# EAGLE schematic PL20_11 (EAGLE 4.01)

## Sheet 1 of 3
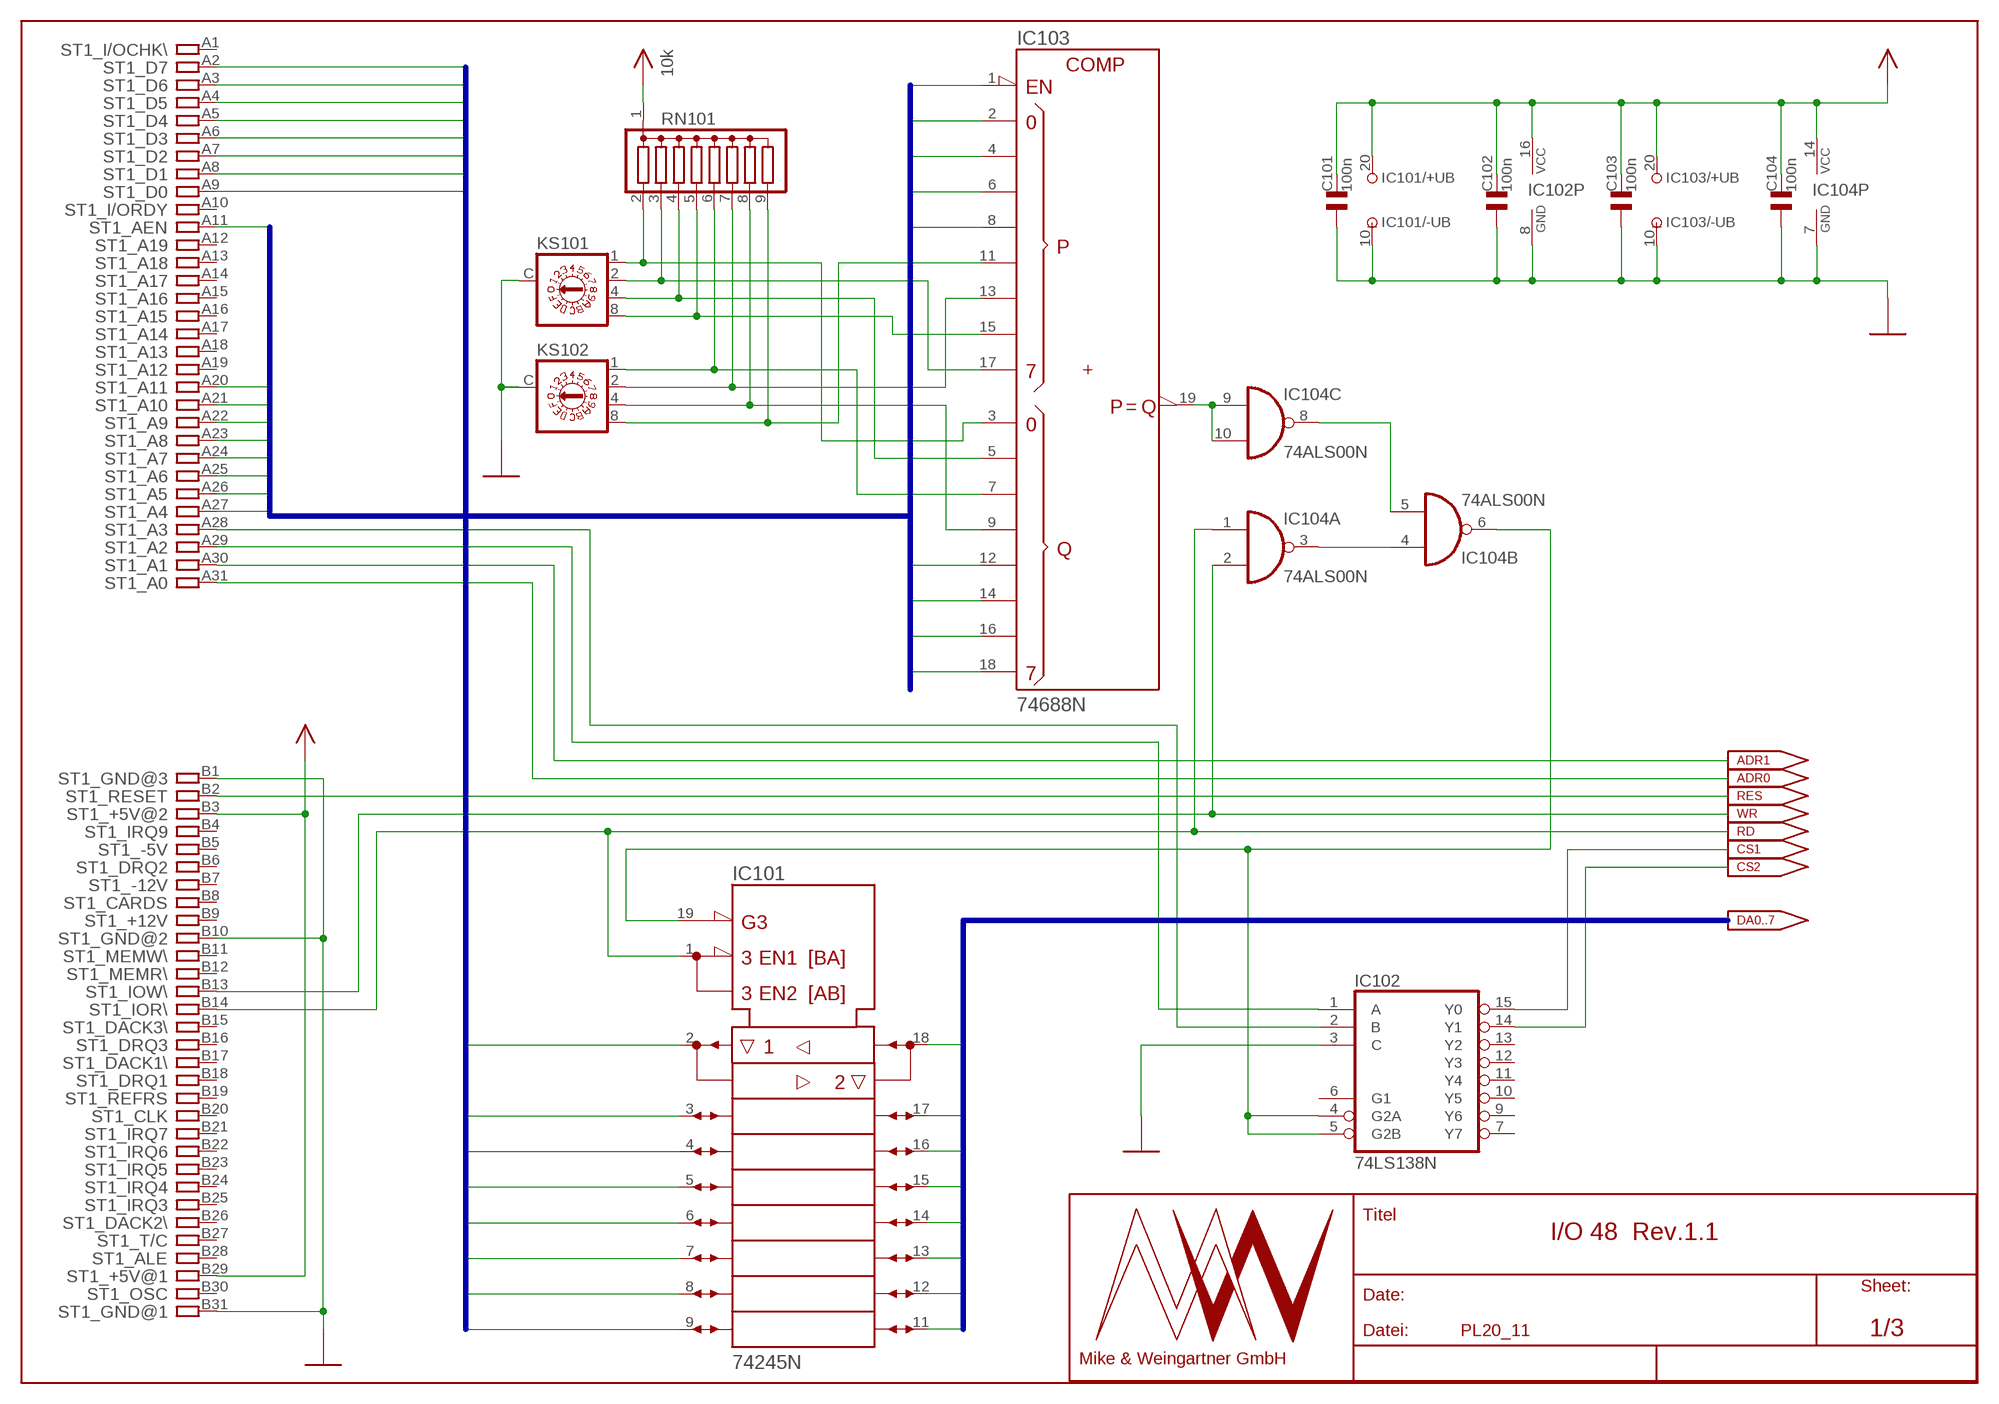
[diagram p0: schematic, sheet 1]

### Parts
C101  100n  C5B2,5  [C5B2,5]
C102  100n  C5B2,5  [C5B2,5]
C103  100n  C5B2,5  [C5B2,5]
C104  100n  C5B2,5  [C5B2,5]
IC101  74245N  [PDIP20]
IC102  74LS138N  [DIL16]
IC103  74688N  [PDIP20]
IC104  74ALS00N  [DIL14]
KS101  S10HEX  [S10HEX]
KS102  S10HEX  [S10HEX]
RN101  G08R  [SIL9]
ST1  8BITPL20"  [8BITPL20]

### Nets
+5V: C101.2 C102.2 C103.2 C104.2 IC101.20(+UB) IC102.16(VCC) IC103.20(+UB) IC104.14(P:VCC) RN101.1 ST1.B3 ST1.B29 ; supply symbol labelled 10k ; also sheet 2,3
ADR0: ST1.A31 ; also sheet 2,3
ADR1: ST1.A30 ; also sheet 2,3
ADR4: IC103.2(P0) ST1.A27
ADR5: IC103.18(Q7) ST1.A26
ADR6: IC103.4(P1) ST1.A25
ADR7: IC103.16(Q6) ST1.A24
ADR8: IC103.6(P2) ST1.A23
ADR9: IC103.14(Q5) ST1.A22
ADR10: IC103.8(P3) ST1.A21
ADR11: IC103.12(Q4) ST1.A20
AEN: IC103.1(G\) ST1.A11
CS1: IC102.15(Y0) ; also sheet 3
CS2: IC102.14(Y1) ; also sheet 2
D0: IC101.2(A1) ST1.A9
D1: IC101.3(A2) ST1.A8
D2: IC101.4(A3) ST1.A7
D3: IC101.5(A4) ST1.A6
D4: IC101.6(A5) ST1.A5
D5: IC101.7(A6) ST1.A4
D6: IC101.8(A7) ST1.A3
D7: IC101.9(A8) ST1.A2
DA0: IC101.18(B1) ; also sheet 2,3
DA1: IC101.17(B2) ; also sheet 2,3
DA2: IC101.16(B3) ; also sheet 2,3
DA3: IC101.15(B4) ; also sheet 2,3
DA4: IC101.14(B5) ; also sheet 2,3
DA5: IC101.13(B6) ; also sheet 2,3
DA6: IC101.12(B7) ; also sheet 2,3
DA7: IC101.11(B8) ; also sheet 2,3
GND: C101.1 C102.1 C103.1 C104.1 IC101.10(-UB) IC102.3(C) IC102.8(GND) IC103.10(-UB) IC104.7(P:GND) KS101.C KS102.C ST1.B1 ST1.B10 ST1.B31 ; also sheet 2,3
N$1: IC103.3(Q0) KS101.1 RN101.2
N$2: IC103.17(P7) KS101.2 RN101.3
N$3: IC103.5(Q1) KS101.4 RN101.4
N$4: IC103.15(P6) KS101.8 RN101.5
N$5: IC103.7(Q2) KS102.1 RN101.6
N$6: IC103.13(P5) KS102.2 RN101.7
N$7: IC103.9(Q3) KS102.4 RN101.8
N$8: IC103.11(P4) KS102.8 RN101.9
N$9: IC103.19(P=Q\) IC104.9(C:I0) IC104.10(C:I1)
N$10: IC102.2(B) ST1.A28
N$11: IC101.19(G\) IC102.4(G2A) IC102.5(G2B) IC104.6(B:O)
N$16: IC104.5(B:I1) IC104.8(C:O)
N$17: IC104.3(A:O) IC104.4(B:I0)
N$18: IC102.1(A) ST1.A29
RD: IC101.1(DIR) IC104.1(A:I0) ST1.B14 ; also sheet 2,3
RES: ST1.B2 ; also sheet 2,3
WR: IC104.2(A:I1) ST1.B13 ; also sheet 2,3
Unconnected: IC102.6(G1) IC102.7(Y7) IC102.9(Y6) IC102.10(Y5) IC102.11(Y4) IC102.12(Y3) IC102.13(Y2) IC104.11(D:O) IC104.12(D:I0) IC104.13(D:I1) ST1.A1 ST1.A10 ST1.A12 ST1.A13 ST1.A14 ST1.A15 ST1.A16 ST1.A17 ST1.A18 ST1.A19 ST1.B4 ST1.B5 ST1.B6 ST1.B7 ST1.B8 ST1.B9 ST1.B11 ST1.B12 ST1.B15 ST1.B16 ST1.B17 ST1.B18 ST1.B19 ST1.B20 ST1.B21 ST1.B22 ST1.B23 ST1.B24 ST1.B25 ST1.B26 ST1.B27 ST1.B28 ST1.B30

### Buses
ADR[4..11],AEN
D[0..7]
DA[0..7]

### Notes on the sheet
- ADR1
- ADR0
- RES
- WR
- RD
- CS1
- CS2
- DA0..7
- I/O 48  Rev.1.1

## Sheet 2 of 3
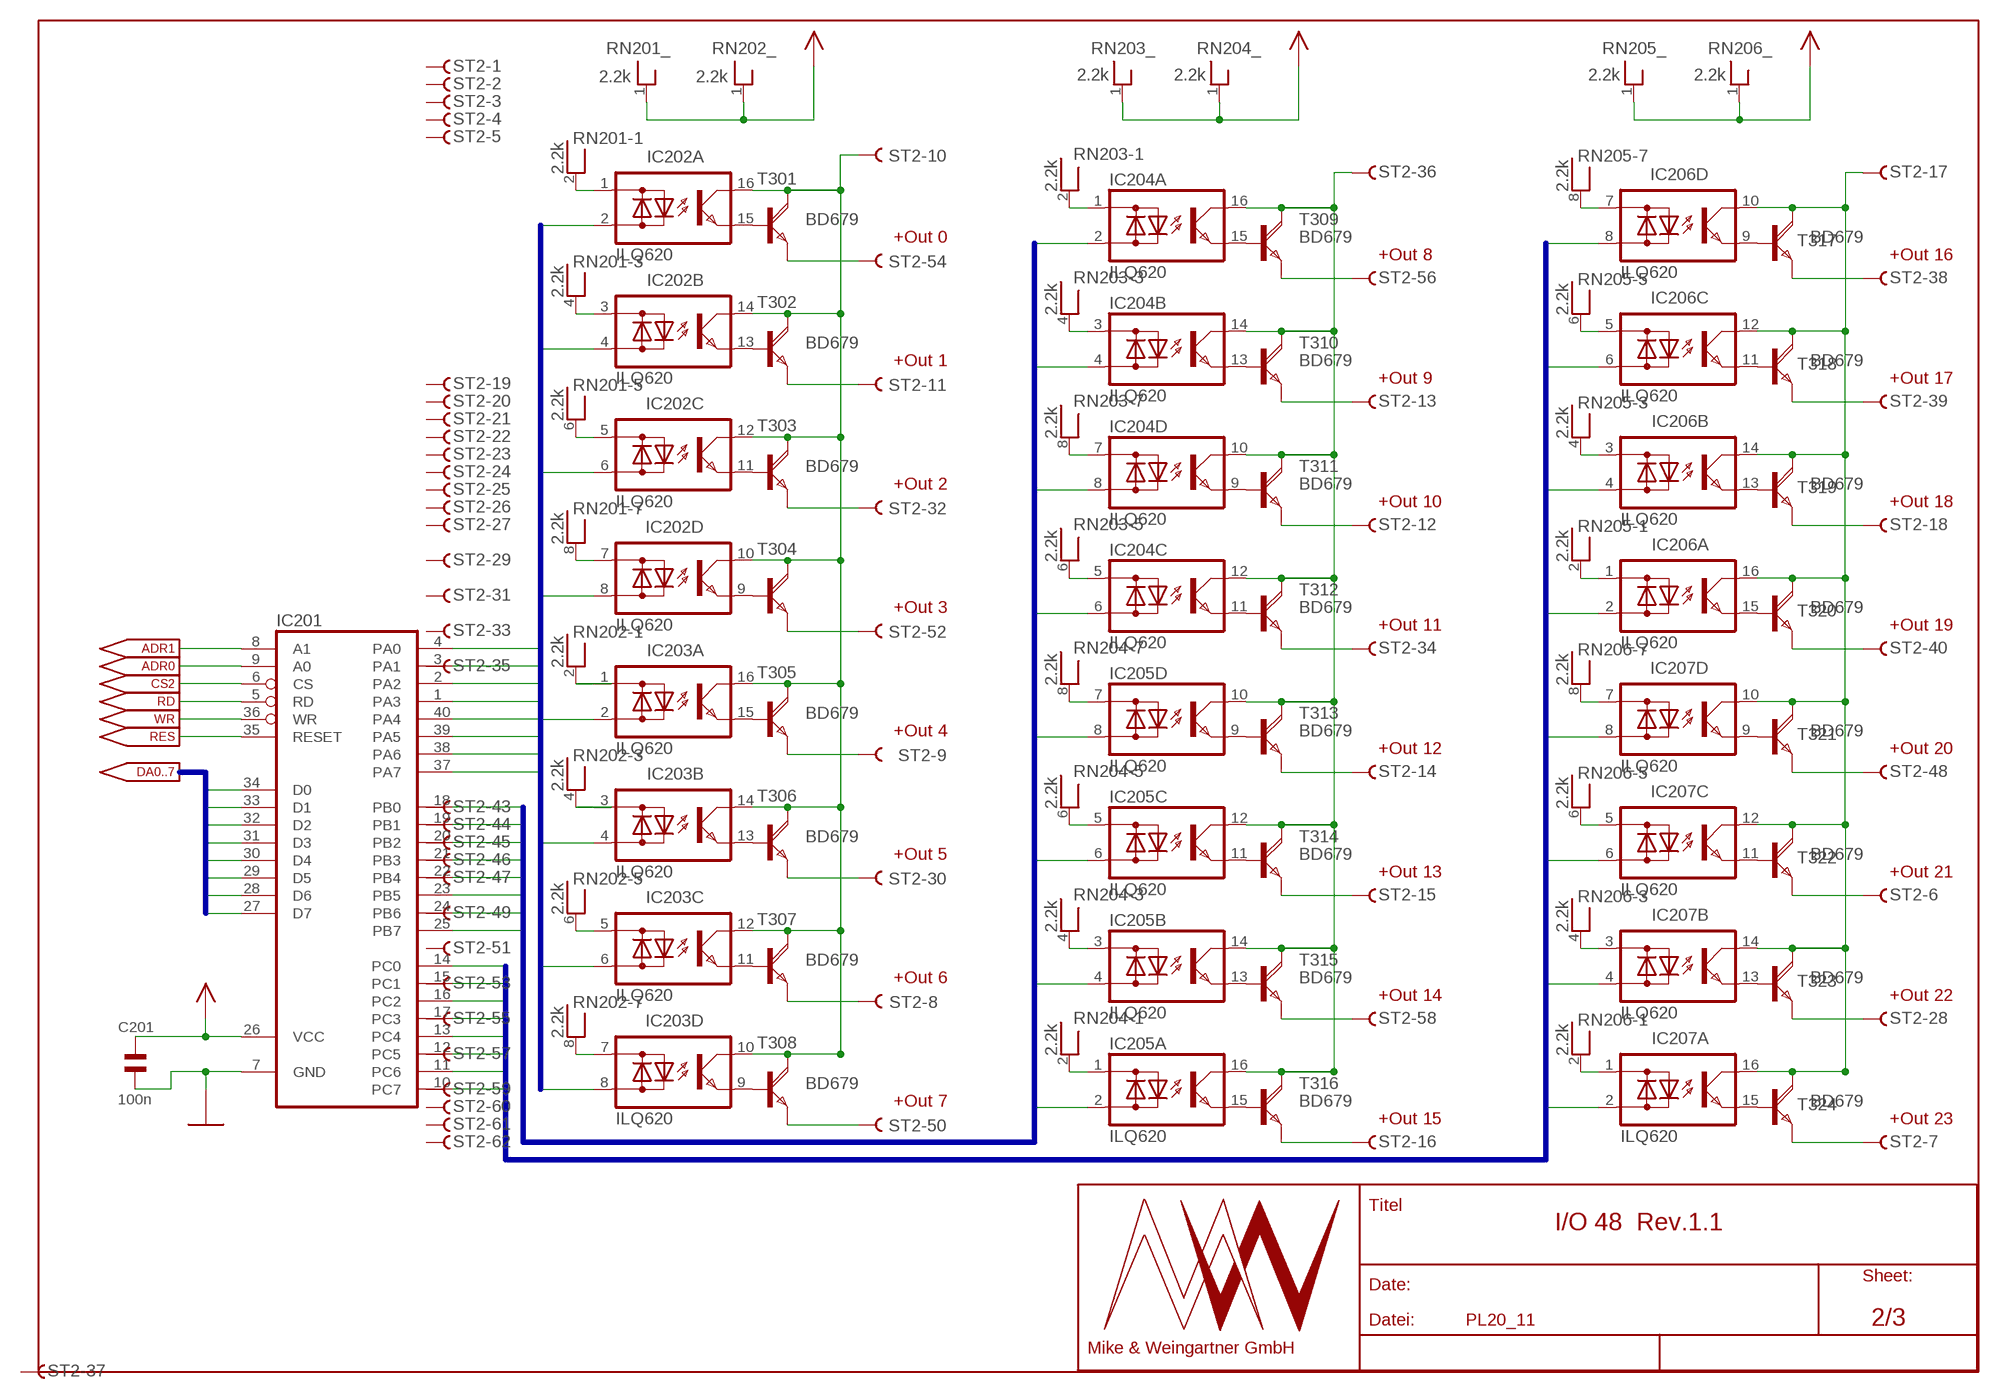
[diagram p1: schematic, sheet 2]

### Parts
C201  100n  C5B2,5  [C5B2,5]
IC201  82C55A  [DIL40]
IC202  ILQ620  [DIL16]
IC203  ILQ620  [DIL16]
IC204  ILQ620  [DIL16]
IC205  ILQ620  [DIL16]
IC206  ILQ620  [DIL16]
IC207  ILQ620  [DIL16]
RN201  2.2k  RNX8  [RN-9]
RN202  2.2k  RNX8  [RN-9]
RN203  2.2k  RNX8  [RN-9]
RN204  2.2k  RNX8  [RN-9]
RN205  2.2k  RNX8  [RN-9]
RN206  2.2k  RNX8  [RN-9]
ST2  HF62HS  [HDF62H]
T301  BD679  [TO126AV]
T302  BD679  [TO126AV]
T303  BD679  [TO126AV]
T304  BD679  [TO126AV]
T305  BD679  [TO126AV]
T306  BD679  [TO126AV]
T307  BD679  [TO126AV]
T308  BD679  [TO126AV]
T309  BD679  [TO126AV]
T310  BD679  [TO126AV]
T311  BD679  [TO126AV]
T312  BD679  [TO126AV]
T313  BD679  [TO126AV]
T314  BD679  [TO126AV]
T315  BD679  [TO126AV]
T316  BD679  [TO126AV]
T317  BD679  [TO126AV]
T318  BD679  [TO126AV]
T319  BD679  [TO126AV]
T320  BD679  [TO126AV]
T321  BD679  [TO126AV]
T322  BD679  [TO126AV]
T323  BD679  [TO126AV]
T324  BD679  [TO126AV]

### Nets
+5V: C201.2 IC201.26(VCC) RN201.1 RN202.1 RN203.1 RN204.1 RN205.1 RN206.1 ; also sheet 1,3
ADR0: IC201.9(A0) ; also sheet 1,3
ADR1: IC201.8(A1) ; also sheet 1,3
CS2: IC201.6(CS) ; also sheet 1
DA0: IC201.34(D0) ; also sheet 1,3
DA1: IC201.33(D1) ; also sheet 1,3
DA2: IC201.32(D2) ; also sheet 1,3
DA3: IC201.31(D3) ; also sheet 1,3
DA4: IC201.30(D4) ; also sheet 1,3
DA5: IC201.29(D5) ; also sheet 1,3
DA6: IC201.28(D6) ; also sheet 1,3
DA7: IC201.27(D7) ; also sheet 1,3
GND: C201.1 IC201.7(GND) ; also sheet 1,3
N$19: IC202.15(A:E) T301.B
N$22: IC202.13(B:E) T302.B
N$23: IC202.11(C:E) T303.B
N$24: IC202.9(D:E) T304.B
N$25: IC203.15(A:E) T305.B
N$26: IC203.13(B:E) T306.B
N$27: IC203.11(C:E) T307.B
N$28: IC203.9(D:E) T308.B
N$29: IC202.10(D:C) IC202.12(C:C) IC202.14(B:C) IC202.16(A:C) IC203.10(D:C) IC203.12(C:C) IC203.14(B:C) IC203.16(A:C) ST2.10 T301.C T302.C T303.C T304.C T305.C T306.C T307.C T308.C
N$30: ST2.54 T301.E
N$31: ST2.11 T302.E
N$32: ST2.32 T303.E
N$33: ST2.52 T304.E
N$34: ST2.9 T305.E
N$35: ST2.30 T306.E
N$36: ST2.8 T307.E
N$38: ST2.50 T308.E
N$39: ST2.56 T309.E
N$40: IC204.15(A:E) T309.B
N$41: IC204.10(D:C) IC204.12(C:C) IC204.14(B:C) IC204.16(A:C) IC205.10(D:C) IC205.12(C:C) IC205.14(B:C) IC205.16(A:C) ST2.36 T309.C T310.C T311.C T312.C T313.C T314.C T315.C T316.C
N$42: IC204.13(B:E) T310.B
N$43: IC205.9(D:E) T313.B
N$44: ST2.13 T310.E
N$45: ST2.12 T311.E
N$46: IC204.9(D:E) T311.B
N$47: IC202.1(A:AC1) RN201.2
N$48: IC202.3(B:AC1) RN201.4
N$49: IC204.11(C:E) T312.B
N$50: ST2.34 T312.E
N$51: IC202.5(C:AC1) RN201.6
N$52: IC202.7(D:AC1) RN201.8
N$53: ST2.14 T313.E
N$54: IC203.5(C:AC1) RN202.6
N$55: IC205.11(C:E) T314.B
N$56: ST2.15 T314.E
N$57: IC203.7(D:AC1) RN202.8
N$58: IC205.13(B:E) T315.B
N$59: ST2.58 T315.E
N$60: IC204.1(A:AC1) RN203.2
N$61: IC205.15(A:E) T316.B
N$62: ST2.16 T316.E
N$63: IC204.3(B:AC1) RN203.4
N$64: IC204.7(D:AC1) RN203.8
N$65: IC204.5(C:AC1) RN203.6
N$66: IC205.7(D:AC1) RN204.8
N$67: IC203.1(A:AC1) RN202.2
N$68: IC203.3(B:AC1) RN202.4
N$69: IC205.5(C:AC1) RN204.6
N$70: IC205.3(B:AC1) RN204.4
N$71: IC205.1(A:AC1) RN204.2
N$72: IC206.10(D:C) IC206.12(C:C) IC206.14(B:C) IC206.16(A:C) IC207.10(D:C) IC207.12(C:C) IC207.14(B:C) IC207.16(A:C) ST2.17 T317.C T318.C T319.C T320.C T321.C T322.C T323.C T324.C
N$73: IC206.9(D:E) T317.B
N$74: IC206.11(C:E) T318.B
N$75: IC206.13(B:E) T319.B
N$76: IC206.15(A:E) T320.B
N$77: IC207.9(D:E) T321.B
N$78: IC207.11(C:E) T322.B
N$79: IC207.13(B:E) T323.B
N$80: IC207.15(A:E) T324.B
N$81: ST2.38 T317.E
N$82: ST2.39 T318.E
N$83: ST2.18 T319.E
N$84: ST2.40 T320.E
N$85: ST2.48 T321.E
N$86: ST2.6 T322.E
N$87: ST2.28 T323.E
N$88: ST2.7 T324.E
N$89: IC206.7(D:AC1) RN205.8
N$90: IC206.5(C:AC1) RN205.6
N$91: IC206.3(B:AC1) RN205.4
N$92: IC206.1(A:AC1) RN205.2
N$93: IC207.7(D:AC1) RN206.8
N$94: IC207.3(B:AC1) RN206.4
N$95: IC207.5(C:AC1) RN206.6
N$96: IC207.1(A:AC1) RN206.2
PA0: IC201.4(PA0) IC202.2(A:AC2)
PA1: IC201.3(PA1) IC202.4(B:AC2)
PA2: IC201.2(PA2) IC202.6(C:AC2)
PA3: IC201.1(PA3) IC202.8(D:AC2)
PA4: IC201.40(PA4) IC203.2(A:AC2)
PA5: IC201.39(PA5) IC203.4(B:AC2)
PA6: IC201.38(PA6) IC203.6(C:AC2)
PA7: IC201.37(PA7) IC203.8(D:AC2)
PB0: IC201.18(PB0) IC204.2(A:AC2)
PB1: IC201.19(PB1) IC204.4(B:AC2)
PB2: IC201.20(PB2) IC204.8(D:AC2)
PB3: IC201.21(PB3) IC204.6(C:AC2)
PB4: IC201.22(PB4) IC205.8(D:AC2)
PB5: IC201.23(PB5) IC205.6(C:AC2)
PB6: IC201.24(PB6) IC205.4(B:AC2)
PB7: IC201.25(PB7) IC205.2(A:AC2)
PC0: IC201.14(PC0) IC206.8(D:AC2)
PC1: IC201.15(PC1) IC206.6(C:AC2)
PC2: IC201.16(PC2) IC206.4(B:AC2)
PC3: IC201.17(PC3) IC206.2(A:AC2)
PC4: IC201.13(PC4) IC207.8(D:AC2)
PC5: IC201.12(PC5) IC207.6(C:AC2)
PC6: IC201.11(PC6) IC207.4(B:AC2)
PC7: IC201.10(PC7) IC207.2(A:AC2)
RD: IC201.5(RD) ; also sheet 1,3
RES: IC201.35(RESET) ; also sheet 1,3
WR: IC201.36(WR) ; also sheet 1,3
Unconnected: RN201.3 RN201.5 RN201.7 RN201.9 RN202.3 RN202.5 RN202.7 RN202.9 RN203.3 RN203.5 RN203.7 RN203.9 RN204.3 RN204.5 RN204.7 RN204.9 RN205.3 RN205.5 RN205.7 RN205.9 RN206.3 RN206.5 RN206.7 RN206.9 ST2.41 ST2.42

### Buses
PA[0..7]
PB[0..7]
PC[0..7]
DA[0..7]

### Notes on the sheet
- +Out 0
- +Out 8 | +Out 16
- +Out 1
- +Out 9 | +Out 17
- +Out 2
- +Out 10 | +Out 18
- +Out 3
- +Out 11 | +Out 19
- ADR1
- ADR0
- CS2
- RD
- WR
- RES
- +Out 4
- +Out 12 | +Out 20
- DA0..7
- +Out 5
- +Out 13 | +Out 21
- +Out 6
- +Out 14 | +Out 22
- +Out 7
- +Out 15 | +Out 23
- I/O 48  Rev.1.1

## Sheet 3 of 3
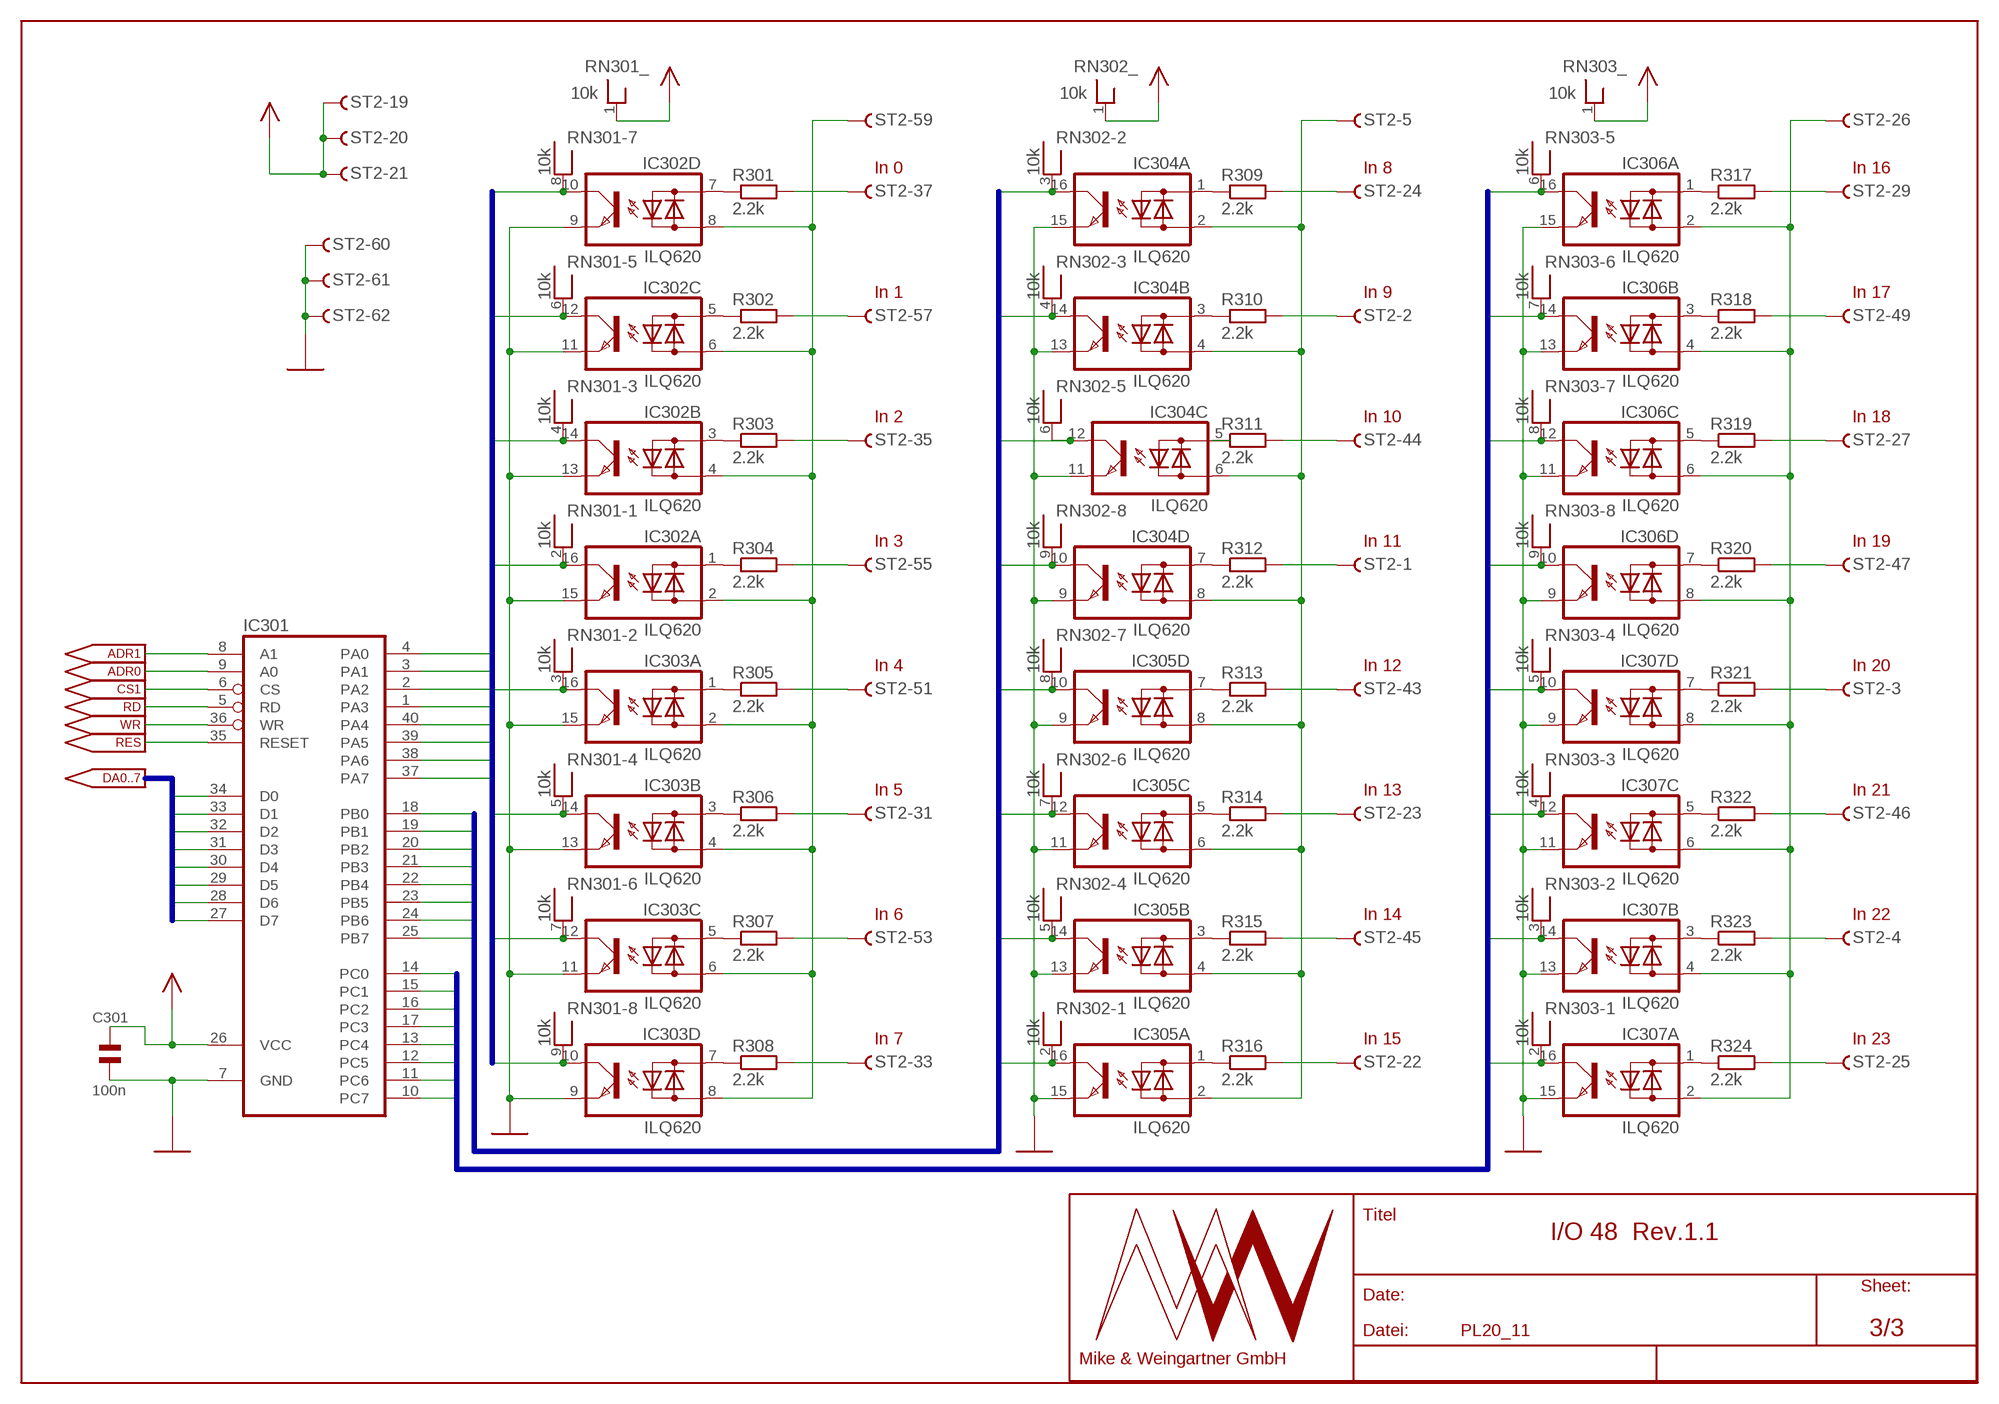
[diagram p2: schematic, sheet 3]

### Parts
C301  100n  C5B2,5  [C5B2,5]
IC301  82C55A  [DIL40]
IC302  ILQ620  [DIL16]
IC303  ILQ620  [DIL16]
IC304  ILQ620  [DIL16]
IC305  ILQ620  [DIL16]
IC306  ILQ620  [DIL16]
IC307  ILQ620  [DIL16]
R301  2.2k  R-EU_0309/10  [0309/10]
R302  2.2k  R-EU_0309/10  [0309/10]
R303  2.2k  R-EU_0309/10  [0309/10]
R304  2.2k  R-EU_0309/10  [0309/10]
R305  2.2k  R-EU_0309/10  [0309/10]
R306  2.2k  R-EU_0309/10  [0309/10]
R307  2.2k  R-EU_0309/10  [0309/10]
R308  2.2k  R-EU_0309/10  [0309/10]
R309  2.2k  R-EU_0309/10  [0309/10]
R310  2.2k  R-EU_0309/10  [0309/10]
R311  2.2k  R-EU_0309/10  [0309/10]
R312  2.2k  R-EU_0309/10  [0309/10]
R313  2.2k  R-EU_0309/10  [0309/10]
R314  2.2k  R-EU_0309/10  [0309/10]
R315  2.2k  R-EU_0309/10  [0309/10]
R316  2.2k  R-EU_0309/10  [0309/10]
R317  2.2k  R-EU_0309/10  [0309/10]
R318  2.2k  R-EU_0309/10  [0309/10]
R319  2.2k  R-EU_0309/10  [0309/10]
R320  2.2k  R-EU_0309/10  [0309/10]
R321  2.2k  R-EU_0309/10  [0309/10]
R322  2.2k  R-EU_0309/10  [0309/10]
R323  2.2k  R-EU_0309/10  [0309/10]
R324  2.2k  R-EU_0309/10  [0309/10]
RN301  10k  RNX8  [RN-9]
RN302  10k  RNX8  [RN-9]
RN303  10k  RNX8  [RN-9]

### Nets
+5V: C301.2 IC301.26(VCC) RN301.1 RN302.1 RN303.1 ST2.19 ST2.20 ST2.21 ; also sheet 1,2
ADR0: IC301.9(A0) ; also sheet 1,2
ADR1: IC301.8(A1) ; also sheet 1,2
CS1: IC301.6(CS) ; also sheet 1
DA0: IC301.34(D0) ; also sheet 1,2
DA1: IC301.33(D1) ; also sheet 1,2
DA2: IC301.32(D2) ; also sheet 1,2
DA3: IC301.31(D3) ; also sheet 1,2
DA4: IC301.30(D4) ; also sheet 1,2
DA5: IC301.29(D5) ; also sheet 1,2
DA6: IC301.28(D6) ; also sheet 1,2
DA7: IC301.27(D7) ; also sheet 1,2
GND: C301.1 IC301.7(GND) IC302.9(D:E) IC302.11(C:E) IC302.13(B:E) IC302.15(A:E) IC303.9(D:E) IC303.11(C:E) IC303.13(B:E) IC303.15(A:E) IC304.9(D:E) IC304.11(C:E) IC304.13(B:E) IC304.15(A:E) IC305.9(D:E) IC305.11(C:E) IC305.13(B:E) IC305.15(A:E) IC306.9(D:E) IC306.11(C:E) IC306.13(B:E) IC306.15(A:E) IC307.9(D:E) IC307.11(C:E) IC307.13(B:E) IC307.15(A:E) ST2.60 ST2.61 ST2.62 ; also sheet 1,2
N$12: IC305.1(A:AC1) R316.1
N$13: IC305.3(B:AC1) R315.1
N$14: IC305.5(C:AC1) R314.1
N$15: IC305.7(D:AC1) R313.1
N$20: IC304.7(D:AC1) R312.1
N$21: IC304.5(C:AC1) R311.1
N$37: R317.2 ST2.29
N$97: IC306.1(A:AC1) R317.1
N$98: IC306.3(B:AC1) R318.1
N$99: IC306.5(C:AC1) R319.1
N$100: IC306.7(D:AC1) R320.1
N$101: R318.2 ST2.49
N$102: IC307.7(D:AC1) R321.1
N$103: IC307.5(C:AC1) R322.1
N$104: IC307.3(B:AC1) R323.1
N$105: IC307.1(A:AC1) R324.1
N$106: R319.2 ST2.27
N$107: R320.2 ST2.47
N$108: R321.2 ST2.3
N$109: R322.2 ST2.46
N$110: R323.2 ST2.4
N$111: R324.2 ST2.25
N$112: IC306.2(A:AC2) IC306.4(B:AC2) IC306.6(C:AC2) IC306.8(D:AC2) IC307.2(A:AC2) IC307.4(B:AC2) IC307.6(C:AC2) IC307.8(D:AC2) ST2.26
N$121: IC304.3(B:AC1) R310.1
N$122: IC304.1(A:AC1) R309.1
N$123: R309.2 ST2.24
N$124: R310.2 ST2.2
N$125: R311.2 ST2.44
N$126: R312.2 ST2.1
N$127: R313.2 ST2.43
N$128: R314.2 ST2.23
N$129: R315.2 ST2.45
N$130: R316.2 ST2.22
N$131: IC304.2(A:AC2) IC304.4(B:AC2) IC304.6(C:AC2) IC304.8(D:AC2) IC305.2(A:AC2) IC305.4(B:AC2) IC305.6(C:AC2) IC305.8(D:AC2) ST2.5
N$140: IC302.7(D:AC1) R301.1
N$141: IC302.5(C:AC1) R302.1
N$142: IC302.3(B:AC1) R303.1
N$143: IC302.1(A:AC1) R304.1
N$144: IC303.1(A:AC1) R305.1
N$145: IC303.3(B:AC1) R306.1
N$146: IC303.5(C:AC1) R307.1
N$147: IC303.7(D:AC1) R308.1
N$148: R301.2 ST2.37
N$149: R302.2 ST2.57
N$150: R303.2 ST2.35
N$151: R304.2 ST2.55
N$152: R305.2 ST2.51
N$153: R306.2 ST2.31
N$154: R307.2 ST2.53
N$155: R308.2 ST2.33
N$156: IC302.2(A:AC2) IC302.4(B:AC2) IC302.6(C:AC2) IC302.8(D:AC2) IC303.2(A:AC2) IC303.4(B:AC2) IC303.6(C:AC2) IC303.8(D:AC2) ST2.59
PAI0: IC301.4(PA0) IC302.10(D:C) RN301.8
PAI1: IC301.3(PA1) IC302.12(C:C) RN301.6
PAI2: IC301.2(PA2) IC302.14(B:C) RN301.4
PAI3: IC301.1(PA3) IC302.16(A:C) RN301.2
PAI4: IC301.40(PA4) IC303.16(A:C) RN301.3
PAI5: IC301.39(PA5) IC303.14(B:C) RN301.5
PAI6: IC301.38(PA6) IC303.12(C:C) RN301.7
PAI7: IC301.37(PA7) IC303.10(D:C) RN301.9
PBI0: IC301.18(PB0) IC304.16(A:C) RN302.3
PBI1: IC301.19(PB1) IC304.14(B:C) RN302.4
PBI2: IC301.20(PB2) IC304.12(C:C) RN302.6
PBI3: IC301.21(PB3) IC304.10(D:C) RN302.9
PBI4: IC301.22(PB4) IC305.10(D:C) RN302.8
PBI5: IC301.23(PB5) IC305.12(C:C) RN302.7
PBI6: IC301.24(PB6) IC305.14(B:C) RN302.5
PBI7: IC301.25(PB7) IC305.16(A:C) RN302.2
PCI0: IC301.14(PC0) IC306.16(A:C) RN303.6
PCI1: IC301.15(PC1) IC306.14(B:C) RN303.7
PCI2: IC301.16(PC2) IC306.12(C:C) RN303.8
PCI3: IC301.17(PC3) IC306.10(D:C) RN303.9
PCI4: IC301.13(PC4) IC307.10(D:C) RN303.5
PCI5: IC301.12(PC5) IC307.12(C:C) RN303.4
PCI6: IC301.11(PC6) IC307.14(B:C) RN303.3
PCI7: IC301.10(PC7) IC307.16(A:C) RN303.2
RD: IC301.5(RD) ; also sheet 1,2
RES: IC301.35(RESET) ; also sheet 1,2
WR: IC301.36(WR) ; also sheet 1,2

### Buses
PCI[0..7]
PBI[0..7]
DA[0..7]
PAI[0..7]

### Notes on the sheet
- In 0 | In 8 | In 16
- In 1 | In 9 | In 17
- In 2 | In 10 | In 18
- In 3 | In 11 | In 19
- ADR1
- ADR0
- In 4 | In 12 | In 20
- CS1
- RD
- WR
- RES
- DA0..7
- In 5 | In 13 | In 21
- In 6 | In 14 | In 22
- In 7 | In 15 | In 23
- I/O 48  Rev.1.1

## Library data of the parts
C101-C104 C201 C301 = cap:C5B2,5
IC101 = 74ttl-din:74*245: Octal BUS TRANSCEIVER, 3-state
IC102 = 74xx-eu:74*138: 3-line to 8-line DECODER/DEMULTIPLEXER
IC103 = 74ttl-din:74*688: 8-bit MAGNITUDE/IDENTITY COMPARATOR, totem pole
IC104 = 74xx-eu:74*00: Quad 2-input NAND gate
IC201 IC301 = micro-intel:82C55A: MICROCOMPUTER/PERIPHERAL DEVICE
IC202-IC207 IC302-IC307 = optocoupler:ILQ620: SIEMENS OPTO COUPLER
KS101 KS102 = dilswtch:S10HEX
R301-R324 = rcl:R-EU_: RESISTOR, European symbol
RN101 = resistor-sil:G08R: SIL RESISTOR
RN201-RN206 RN301-RN303 = resistor-net:RNX8: RESISTOR NETWORK
ST1 = CONNECT:8BITPL20
ST2 = con-subd:HF62HS: HARTING SUB-D
T301-T324 = transistor-power:BD679: NPN DARLINGTON TRANSISTOR